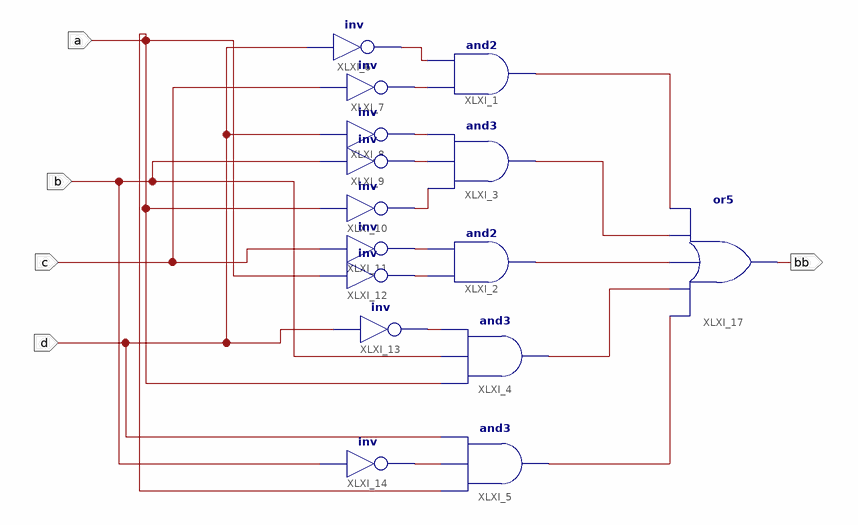
[diagram p0: schematic sheet 1]
// Xilinx ISE schematic hexb.sch (spartan6) as structural Verilog: 15 symbols, 5 ports
module hexb (
  input  b,
  input  c,
  input  d,
  input  a,
  output bb
);

  wire XLXN_1, XLXN_2, XLXN_3, XLXN_4, XLXN_5, XLXN_6, XLXN_7, XLXN_8, XLXN_9, XLXN_10, XLXN_11, XLXN_12,
       XLXN_13, XLXN_14;

  and XLXI_1 (XLXN_10, XLXN_2, XLXN_1);
  and XLXI_2 (XLXN_12, XLXN_7, XLXN_6);
  and XLXI_3 (XLXN_11, XLXN_5, XLXN_4, XLXN_3);
  and XLXI_4 (XLXN_13, a, b, XLXN_8);
  and XLXI_5 (XLXN_14, a, XLXN_9, d);
  not XLXI_6 (XLXN_1, d);
  not XLXI_7 (XLXN_2, c);
  not XLXI_8 (XLXN_3, d);
  not XLXI_9 (XLXN_4, b);
  not XLXI_10 (XLXN_5, a);
  not XLXI_11 (XLXN_6, c);
  not XLXI_12 (XLXN_7, a);
  not XLXI_13 (XLXN_8, d);
  not XLXI_14 (XLXN_9, b);
  or XLXI_17 (bb, XLXN_14, XLXN_13, XLXN_12, XLXN_11, XLXN_10);
endmodule
